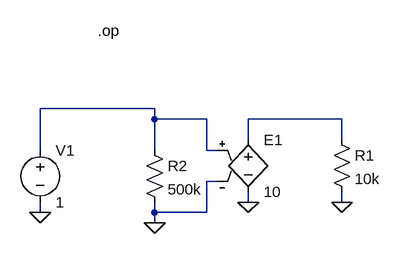
[diagram p0: schematic prueba.asc]
prueba.asc, the LTspice schematic file:
Version 4
SHEET 1 880 680
WIRE 112 96 -64 96
WIRE 112 112 112 96
WIRE 192 112 112 112
WIRE 400 112 256 112
WIRE 256 144 256 112
WIRE 400 144 400 112
WIRE -64 160 -64 96
WIRE 112 160 112 112
WIRE 192 160 192 112
WIRE 208 160 192 160
WIRE 208 208 192 208
WIRE 256 240 256 224
WIRE 400 240 400 224
WIRE -64 256 -64 240
WIRE 112 256 112 240
WIRE 192 256 192 208
WIRE 192 256 112 256
WIRE 112 272 112 256
FLAG 256 240 0
FLAG 400 240 0
FLAG 112 272 0
FLAG -64 256 0
SYMBOL e 256 128 R0
SYMATTR InstName E1
SYMATTR Value 10
SYMATTR SpiceModel value
SYMBOL res 384 128 R0
SYMATTR InstName R1
SYMATTR Value 10k
SYMBOL res 96 144 R0
SYMATTR InstName R2
SYMATTR Value 500k
SYMBOL voltage -64 144 R0
WINDOW 123 0 0 Left 0
WINDOW 39 0 0 Left 0
SYMATTR InstName V1
SYMATTR Value 1
TEXT 24 -24 Left 2 !.op

The netlist it stands for:
* prueba.asc
E1 N002 0 N001 0 value 10
R1 N002 0 10k
R2 N001 0 500k
V1 N001 0 1
.op
.backanno
.end